# Altium schematic sheet TopLevelConnections.SchDoc: Top Level Sch Abstraction
size A4; ApprovedBy: Diogo Gomes; CheckedBy: Bruno, Candido, Pedro; Author: João Vieira; CompanyName: LART; DrawnBy: João Vieira; Organization: LART; Address1: Morro do lena; Address2: Alto Do Vieiro; Address3: APT 4163, Building D; Revision: v1.4.2; SheetNumber: 1; SheetTotal: 7; ProjectTitle: Autonomous Control Unit; CheckedBy1: G. Candido; CheckedBy2: F. Chen; CheckedBy3: P. Ferreira; CheckedBy4: B. Vicente; CheckedBy5: _; CheckedBy6: _; CheckedBy7: _; CHK_APP_DATE: --/--/--; DSN_APP_DATE: --/--/--; ENG_APP_DATE: --/--/--; Summary: An Abstract Representation of the wiring between schematics; version_tag: 1.4.2; ImagePath: C:\Users\micron\Desktop
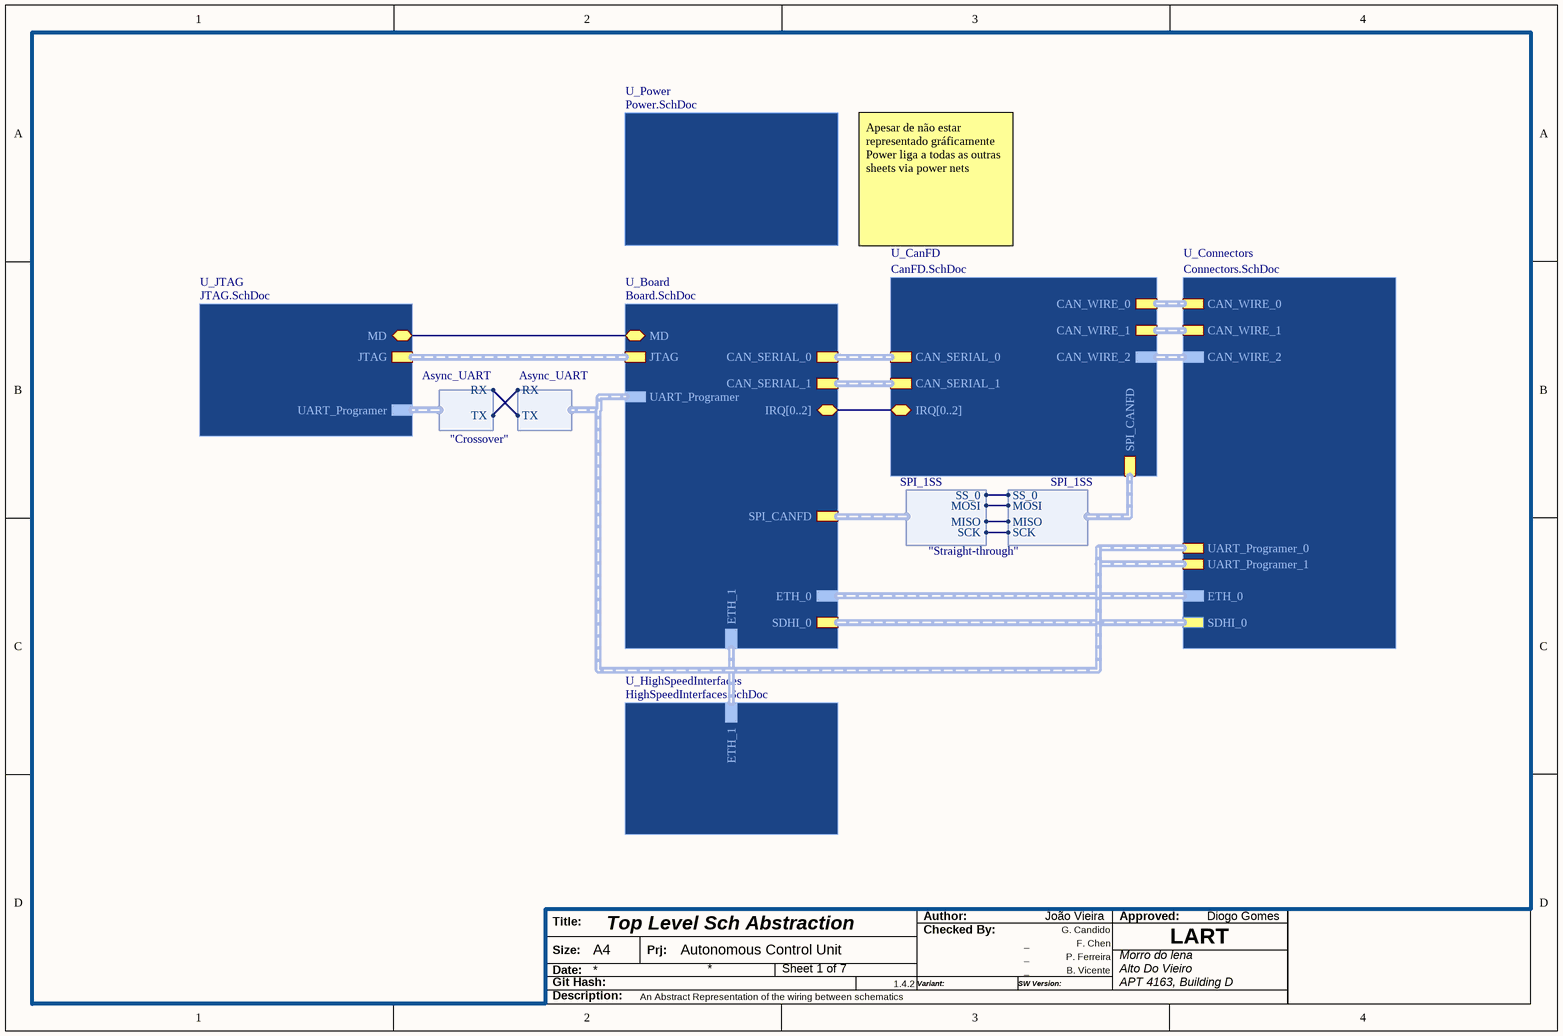
[diagram p0: TopLevelConnections.SchDoc]

## Sub-sheets
U_Board = Board.SchDoc: JTAG (harness JTAG), CAN_SERIAL_0 (harness CAN_SERIAL), CAN_SERIAL_1 (harness CAN_SERIAL), ETH_0 (harness ETH_TX), ETH_1 (harness ETH_TX), UART_Programer (harness Async_UART), SDHI_0 (harness SDHI), SPI_CANFD (harness SPI_1SS), IRQ[0..2] (bidir), MD (bidir)
U_CanFD = CanFD.SchDoc: CAN_SERIAL_0 (harness CAN_SERIAL), CAN_SERIAL_1 (harness CAN_SERIAL), SPI_CANFD (harness SPI_1SS), IRQ[0..2] (bidir), CAN_WIRE_1 (harness CAN_WIRE), CAN_WIRE_0 (harness CAN_WIRE), CAN_WIRE_2 (harness CAN_WIRE)
U_Connectors = Connectors.SchDoc: ETH_0 (harness ETH_TX), SDHI_0 (harness SDHI), CAN_WIRE_0 (harness CAN_WIRE), CAN_WIRE_1 (harness CAN_WIRE), CAN_WIRE_2 (harness CAN_WIRE), UART_Programer_0 (harness Async_UART), UART_Programer_1 (harness Async_UART)
U_HighSpeedInterfaces = HighSpeedInterfaces.SchDoc: ETH_1 (harness ETH_TX)
U_JTAG = JTAG.SchDoc: JTAG (harness JTAG), UART_Programer (harness Async_UART), MD (bidir)
U_Power = Power.SchDoc: no entries

## Harnesses
Async_UART: RX, TX
SPI_1SS: MOSI, MISO, SCK, SS_0

## Nets
(unnamed): sheet U_Board/MD, sheet U_JTAG/MD
(unnamed): sheet U_Connectors/UART_Programer_0.RX, sheet U_JTAG/UART_Programer.TX
(unnamed): sheet U_Connectors/UART_Programer_0.TX, sheet U_JTAG/UART_Programer.RX
(unnamed): sheet U_Board/SPI_CANFD.MOSI, sheet U_CanFD/SPI_CANFD.MOSI
(unnamed): sheet U_Board/SPI_CANFD.MISO, sheet U_CanFD/SPI_CANFD.MISO
(unnamed): sheet U_Board/SPI_CANFD.SCK, sheet U_CanFD/SPI_CANFD.SCK
(unnamed): sheet U_Board/SPI_CANFD.SS_0, sheet U_CanFD/SPI_CANFD.SS_0

## Buses and harness runs
bus sheet U_Board/IRQ[0..2] = sheet U_CanFD/IRQ[0..2]
harness sheet U_Board/CAN_SERIAL_0 = sheet U_CanFD/CAN_SERIAL_0
harness sheet U_Board/CAN_SERIAL_1 = sheet U_CanFD/CAN_SERIAL_1
harness sheet U_Board/ETH_0 = sheet U_Connectors/ETH_0
harness sheet U_Board/ETH_1 = sheet U_HighSpeedInterfaces/ETH_1
harness sheet U_Board/JTAG = sheet U_JTAG/JTAG
harness sheet U_Board/SDHI_0 = sheet U_Connectors/SDHI_0
harness sheet U_Board/UART_Programer = sheet U_Connectors/UART_Programer_0 = sheet U_Connectors/UART_Programer_1
harness sheet U_CanFD/CAN_WIRE_0 = sheet U_Connectors/CAN_WIRE_0
harness sheet U_CanFD/CAN_WIRE_1 = sheet U_Connectors/CAN_WIRE_1
harness sheet U_CanFD/CAN_WIRE_2 = sheet U_Connectors/CAN_WIRE_2

## Notes on the sheet
- Apesar de não estar representado gráficamente
  Power liga a todas as outras sheets via power nets
- "Crossover"
- "Straight-through"
- Title:
- Author:
- Checked By:
- Approved:
- Size:
- Date:
- Git Hash:
- A4
- Prj:
- Variant:
- SW Version:
- Description: